# EAGLE design BLDC Motor (EAGLE 7.3.0)
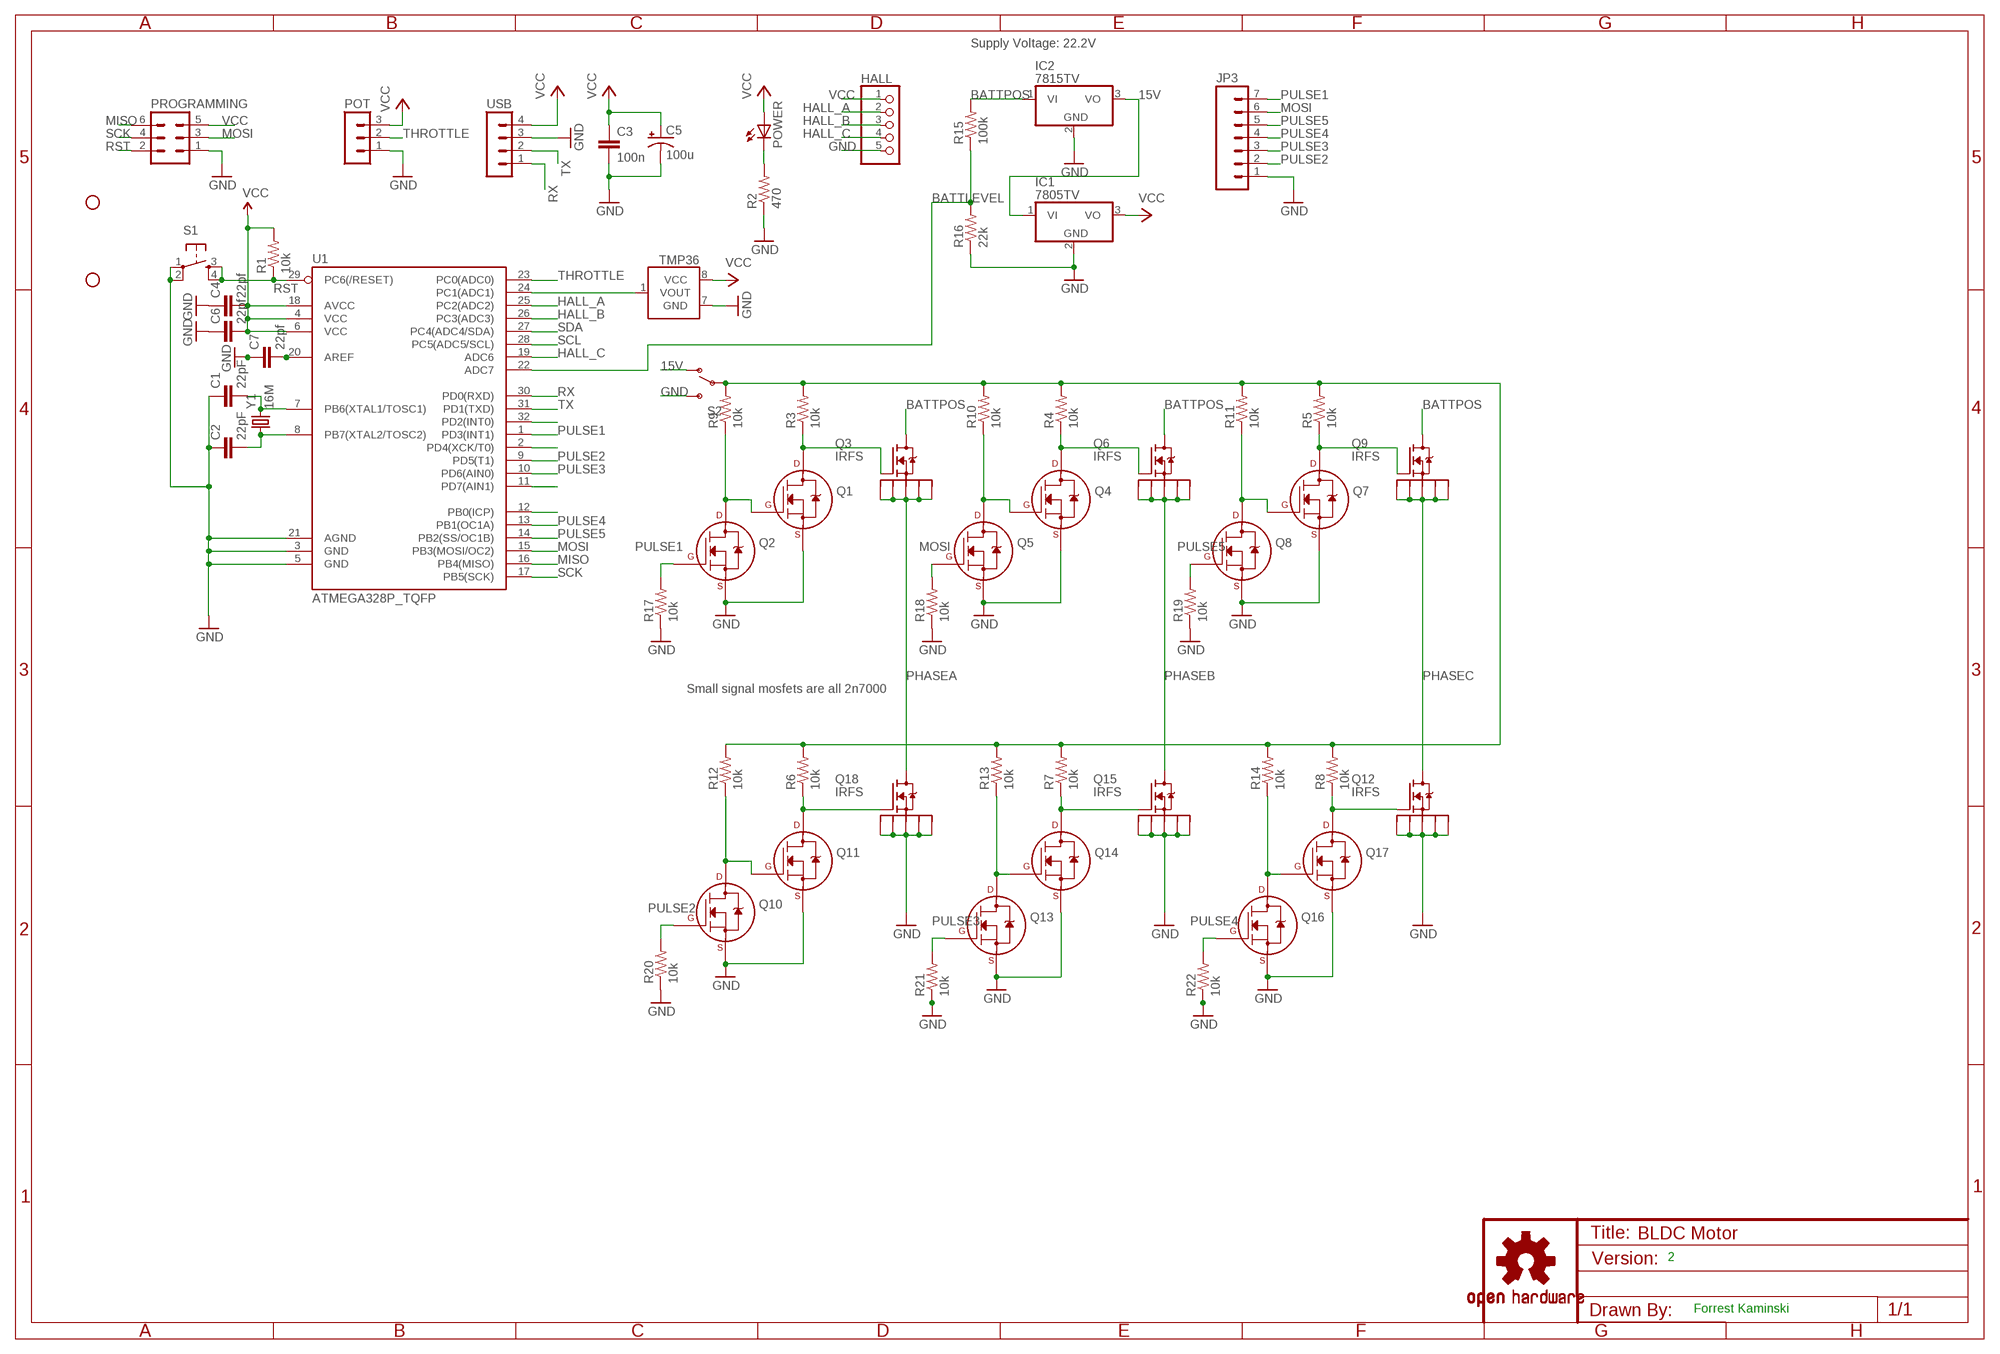
[diagram p0: schematic, sheet 1]

## Parts
C1  22pF  CAP0805  [0805]
C2  22pF  CAP0805  [0805]
C3  100n  CAP0805  [0805]
C4  22pf  CAP0805  [0805]
C5  100u  CAP_POLPTH1  [CPOL-RADIAL-100UF-25V]
C6  22pf  CAP0805  [0805]
C7  22pf  CAP0805  [0805]
HALL  PINHD-1X5  [1X05]
IC1  7805TV  [TO220V]
IC2  7815TV  [TO220V]
JP1  STAND-OFF  [STAND-OFF]
JP2  STAND-OFF  [STAND-OFF]
JP3  M07  [1X07]
POT  MA03-1  [MA03-1]
POWER  LEDSML0805  [SML0805]
PROGRAMMING  MA03-2  [MA03-2]
Q1  2N7000_TO92  [TO-92]
Q2  2N7000_TO92  [TO-92]
Q3  IRFS  NMOSFET-D2PAK-7  [D2PAK-7]
Q4  2N7000_TO92  [TO-92]
Q5  2N7000_TO92  [TO-92]
Q6  IRFS  NMOSFET-D2PAK-7  [D2PAK-7]
Q7  2N7000_TO92  [TO-92]
Q8  2N7000_TO92  [TO-92]
Q9  IRFS  NMOSFET-D2PAK-7  [D2PAK-7]
Q10  2N7000_TO92  [TO-92]
Q11  2N7000_TO92  [TO-92]
Q12  IRFS  NMOSFET-D2PAK-7  [D2PAK-7]
Q13  2N7000_TO92  [TO-92]
Q14  2N7000_TO92  [TO-92]
Q15  IRFS  NMOSFET-D2PAK-7  [D2PAK-7]
Q16  2N7000_TO92  [TO-92]
Q17  2N7000_TO92  [TO-92]
Q18  IRFS  NMOSFET-D2PAK-7  [D2PAK-7]
R1  10k  RESISTOR0805-RES  [0805]
R2  470  RESISTOR0805-RES  [0805]
R3  10k  RESISTOR0805-RES  [0805]
R4  10k  RESISTOR0805-RES  [0805]
R5  10k  RESISTOR0805-RES  [0805]
R6  10k  RESISTOR0805-RES  [0805]
R7  10k  RESISTOR0805-RES  [0805]
R8  10k  RESISTOR0805-RES  [0805]
R9  10k  RESISTOR0805-RES  [0805]
R10  10k  RESISTOR0805-RES  [0805]
R11  10k  RESISTOR0805-RES  [0805]
R12  10k  RESISTOR0805-RES  [0805]
R13  10k  RESISTOR0805-RES  [0805]
R14  10k  RESISTOR0805-RES  [0805]
R15  100k  RESISTOR0805-RES  [0805]
R16  22k  RESISTOR0805-RES  [0805]
R17  10k  RESISTOR0805-RES  [0805]
R18  10k  RESISTOR0805-RES  [0805]
R19  10k  RESISTOR0805-RES  [0805]
R20  10k  RESISTOR0805-RES  [0805]
R21  10k  RESISTOR0805-RES  [0805]
R22  10k  RESISTOR0805-RES  [0805]
S1  TAC_SWITCHPTH  [TACTILE-PTH]
S2  SWITCH-SPSTPTH_LOCK  [SWITCH-SPDT_LOCK.007S]
TMP36  TMP36SOIC  [SOIC8]
U1  ATMEGA328P_TQFP  [TQFP32-08]
U$1  OSHW-LOGOS  [OSHW-LOGO-S]
USB  MA04-1  [MA04-1]
Y1  16M  CRYSTALHC49US  [HC49US]

## Nets
15V: IC1.1(VI) IC2.3(VO) S2.1(O)
BATTLEVEL: R15.1 R16.2 U1.22(ADC7)
BATTPOS: IC2.1(VI) Q3.D Q6.D Q9.D R15.2
GND: C1.1 C2.1 C3.2 C4.1 C5.2(-) C6.1 C7.1 HALL.5 IC1.2(GND) IC2.2(GND) JP3.1 POT.1 PROGRAMMING.1 Q1.1(S) Q2.1(S) Q4.1(S) Q5.1(S) Q7.1(S) Q8.1(S) Q10.1(S) Q11.1(S) Q12.S1 Q12.S2 Q12.S3 Q12.S4 Q12.S5 Q13.1(S) Q14.1(S) Q15.S1 Q15.S2 Q15.S3 Q15.S4 Q15.S5 Q16.1(S) Q17.1(S) Q18.S1 Q18.S2 Q18.S3 Q18.S4 Q18.S5 R2.1 R16.1 R17.1 R18.1 R19.1 R20.1 R21.1 R22.1 S1.1 S1.2 S2.3(S) TMP36.7(GND) U1.3(GND) U1.5(GND) U1.21(AGND) USB.3
HALL_A: HALL.2 U1.25(PC2(ADC2))
HALL_B: HALL.3 U1.26(PC3(ADC3))
HALL_C: HALL.4 U1.19(ADC6)
MISO: PROGRAMMING.6 U1.16(PB4(MISO))
MOSI: JP3.6 PROGRAMMING.3 Q5.2(G) R18.2 U1.15(PB3(MOSI/OC2))
N$1: C2.2 U1.8(PB7(XTAL2/TOSC2)) Y1.1
N$2: C1.2 U1.7(PB6(XTAL1/TOSC1)) Y1.2
N$3: POWER.C R2.2
N$4: Q10.3(D) Q11.2(G) R12.1
N$5: Q1.3(D) Q3.G R3.1
N$6: TMP36.1(VOUT) U1.24(PC1(ADC1))
N$7: C7.2 U1.20(AREF)
N$8: Q1.2(G) Q2.3(D) R9.1
N$9: Q4.3(D) Q6.G R4.1
N$11: Q4.2(G) Q5.3(D) R10.1
N$12: R3.2 R4.2 R5.2 R6.2 R7.2 R8.2 R9.2 R10.2 R11.2 R12.2 R13.2 R14.2 S2.2(P)
N$13: Q7.3(D) Q9.G R5.1
N$14: Q7.2(G) Q8.3(D) R11.1
N$15: U1.32(PD2(INT0))
N$17: U1.2(PD4(XCK/T0))
N$19: Q11.3(D) Q18.G R6.1
N$20: U1.11(PD7(AIN1))
N$21: U1.12(PB0(ICP))
N$22: Q13.3(D) Q14.2(G) R13.1
N$26: Q12.G Q17.3(D) R8.1
N$27: Q16.3(D) Q17.2(G) R14.1
N$28: Q14.3(D) Q15.G R7.1
PHASEA: Q3.S1 Q3.S2 Q3.S3 Q3.S4 Q3.S5 Q18.D
PHASEB: Q6.S1 Q6.S2 Q6.S3 Q6.S4 Q6.S5 Q15.D
PHASEC: Q9.S1 Q9.S2 Q9.S3 Q9.S4 Q9.S5 Q12.D
PULSE1: JP3.7 Q2.2(G) R17.2 U1.1(PD3(INT1))
PULSE2: JP3.2 Q10.2(G) R20.2 U1.9(PD5(T1))
PULSE3: JP3.3 Q13.2(G) R21.2 U1.10(PD6(AIN0))
PULSE4: JP3.4 Q16.2(G) R22.2 U1.13(PB1(OC1A))
PULSE5: JP3.5 Q8.2(G) R19.2 U1.14(PB2(SS/OC1B))
RST: PROGRAMMING.2 R1.1 S1.3 S1.4 U1.29(PC6(/RESET))
RX: U1.30(PD0(RXD)) USB.1
SCK: PROGRAMMING.4 U1.17(PB5(SCK))
SCL: U1.28(PC5(ADC5/SCL))
SDA: U1.27(PC4(ADC4/SDA))
THROTTLE: POT.2 U1.23(PC0(ADC0))
TX: U1.31(PD1(TXD)) USB.2
VCC: C3.1 C4.2 C5.1(+) C6.2 HALL.1 IC1.3(VO) POT.3 POWER.A PROGRAMMING.5 R1.2 TMP36.8(VCC) U1.4(VCC) U1.6(VCC) U1.18(AVCC) USB.4

## Notes on the sheet
- Supply Voltage: 22.2V
- Small signal mosfets are all 2n7000
- 2
- Forrest Kaminski

## Library data of the parts
C1-C4 C6 C7 = SparkFun:CAP: Capacitor Standard 0603 ceramic capacitor, and 0.1" leaded capacitor.
C5 = SparkFun:CAP_POL: Capacitor Polarized These are standard SMD and PTH capacitors. Normally 10uF, 47uF, and 100uF in electrolytic and tantalum varieties. Always verify the external diameter of the through hole cap, it varies with capacity, voltage, and manufacturer. The EIA devices should be standard.
HALL = pinhead:PINHD-1X5: PIN HEADER
IC1 IC2 = linear:78*: Positive VOLTAGE REGULATOR Source: http://cache.national.com/ds/LM/LM78L05.pdf http://www.fairchildsemi.com/ds/LM/LM7805.pdf
JP1 JP2 = SparkFun:STAND-OFF: Stand Off This is the mechanical footprint for a #4 phillips button head screw. Use the keepout ring to avoid running the screw head into surrounding components. SKU : PRT-00447
JP3 = SparkFun:M07: Header 7 Standard 7-pin 0.1" header. Use with straight break away headers (SKU : PRT-00116), right angle break away headers (PRT-00553), swiss pins (PRT-00743), machine pins (PRT-00117), and female headers (PRT-00115). NOTES ON THE VARIANTS LOCK and LOCK_LONGPADS... This footprint was designed to help hold the alignment of a through-hole component (i.e. 7-pin header) while soldering it into place. You may notice that each hole has been shifted either up or down by 0.005 of an inch from it's more standard position (which is usually a perfectly straight line). This slight alteration caused the pins (the squares in the middle) to touch the edges of the holes. Because they are alternating, it causes a "brace" to hold the header in place. 0.005 has proven to be the perfect amount of "off-center" position when using our standard breakaway headers. Although looks a little odd when you look at the bare footprint, once you have a header in there, the alteration is very hard to notice. Also, if you push a header all the way into place, it is covered up entirely on the bottom side. This idea of altering the position of holes to aid alignment will be further integrated into the Sparkfun Library for other footprints. It can help hold any component with 3 or more connection pins.
POT = con-lstb:MA03-1: PIN HEADER; OC_FARNELL: unknown; OC_NEWARK: unknown
POWER = led:LED: LED OSRAM: - CHIPLED LG R971, LG N971, LY N971, LG Q971, LY Q971, LO R971, LY R971 LH N974, LH R974 LS Q976, LO Q976, LY Q976 LO Q996 - Hyper CHIPLED LW Q18S LB Q993, LB Q99A, LB R99A - SideLED LS A670, LO A670, LY A670, LG A670, LP A670 LB A673, LV A673, LT A673, LW A673 LH A674 LY A675 LS A676, LA A676, LO A676, LY A676, LW A676 LS A679, LY A679, LG A679 - Hyper Micro SIDELED® LS Y876, LA Y876, LO Y876, LY Y876 LT Y87S - SmartLED LW L88C, LW L88S LB L89C, LB L89S, LG L890 LS L89K, LO L89K, LY L89K LS L896, LA L896, LO L896, LY L896 - TOPLED LS T670, LO T670, LY T670, LG T670, LP T670 LSG T670, LSP T670, LSY T670, LOP T670, LYG T670 LG T671, LOG T671, LSG T671 LB T673, LV T673, LT T673, LW T673 LH T674 LS T676, LA T676, LO T676, LY T676, LB T676, LH T676, LSB T676, LW T676 LB T67C, LV T67C, LT T67C, LS T67K, LO T67K, LY T67K, LW E67C LS E67B, LA E67B, LO E67B, LY E67B, LB E67C, LV E67C, LT E67C LW T67C LS T679, LY T679, LG T679 LS T770, LO T770, LY T770, LG T770, LP T770 LB T773, LV T773, LT T773, LW T773 LH T774 LS E675, LA E675, LY E675, LS T675 LS T776, LA T776, LO T776, LY T776, LB T776 LHGB T686 LT T68C, LB T68C - Hyper Mini TOPLED® LB M676 - Mini TOPLED Santana® LG M470 LS M47K, LO M47K, LY M47K Source: http://www.osram.convergy.de LUXEON: - LUMILED® LXK2-PW12-R00, LXK2-PW12-S00, LXK2-PW14-U00, LXK2-PW14-V00 LXK2-PM12-R00, LXK2-PM12-S00, LXK2-PM14-U00 LXK2-PE12-Q00, LXK2-PE12-R00, LXK2-PE12-S00, LXK2-PE14-T00, LXK2-PE14-U00 LXK2-PB12-K00, LXK2-PB12-L00, LXK2-PB12-M00, LXK2-PB14-N00, LXK2-PB14-P00, LXK2-PB14-Q00 LXK2-PR12-L00, LXK2-PR12-M00, LXK2-PR14-Q00, LXK2-PR14-R00 LXK2-PD12-Q00, LXK2-PD12-R00, LXK2-PD12-S00 LXK2-PH12-R00, LXK2-PH12-S00 LXK2-PL12-P00, LXK2-PL12-Q00, LXK2-PL12-R00 Source: www.luxeon.com KINGBRIGHT: KA-3528ASYC Source: www.kingbright.com
PROGRAMMING = con-lstb:MA03-2: PIN HEADER; OC_FARNELL: unknown; OC_NEWARK: unknown
Q1 Q2 Q4 Q5 Q7 Q8 Q10 Q11 Q13 Q14 Q16 Q17 = transistors:2N700*: 2N7000, 2N7002, NDS7002A N-channel enhancement mode MOSFET
Q3 Q6 Q9 Q12 Q15 Q18 = D2PAK-7:NMOSFET-D2PAK-7
R1-R22 = SparkFun:RESISTOR: Resistor Basic schematic elements and footprints for 0603, 1206, and PTH resistors.
S1 = SparkFun:TAC_SWITCH: Momentary Switch Button commonly used for reset or general input. Spark Fun Electronics SKU : COM-00097
S2 = SparkFun:SWITCH-SPST: SPST Switch Simple slide switch. Spark Fun Electronics SKU : COM-00102
TMP36 = SparkFun:TMP36
U1 = SparkFun-DigitalIC:ATMEGA328P_TQFP; PROD_ID: IC-09069
U$1 = SparkFun:OSHW-LOGO: Open Source Hardware Logo This logo indicates the piece of hardware it is found on incorporates a OSHW license and/or adheres to the definition of open source hardware found here: http://freedomdefined.org/OSHW
USB = con-lstb:MA04-1: PIN HEADER; OC_FARNELL: unknown; OC_NEWARK: unknown
Y1 = SparkFun:CRYSTAL: Crystals Various standard crystals. Proven footprints. Spark Fun Electronics SKU : COM-00534

## Net classes
0 default: width 0.254 mm, drill 0.152 mm, clearance 0.203 mm

## Board
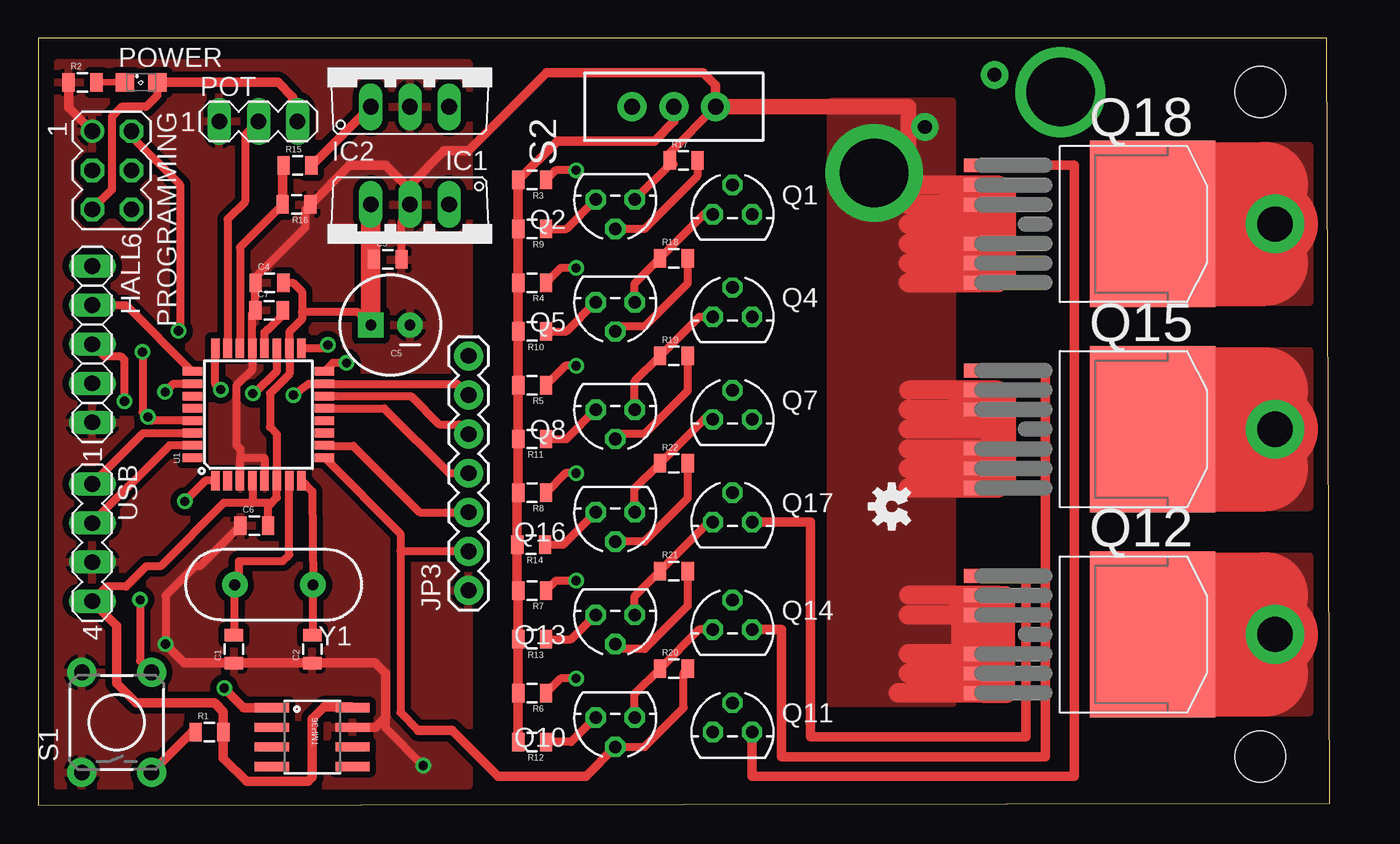
[diagram p1: board, top side]
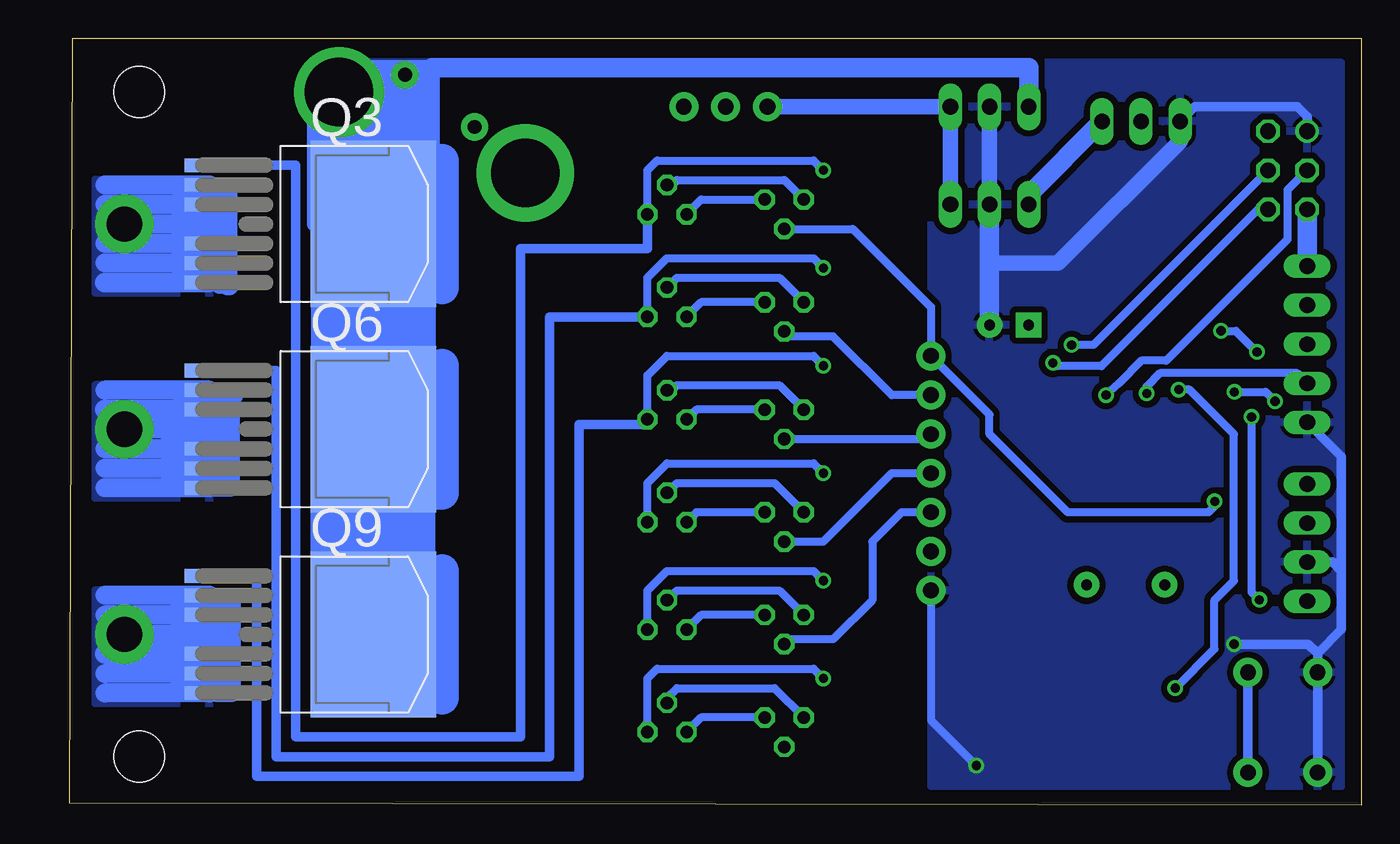
[diagram p2: board, bottom side, seen from below]

Size 83.87 x 49.84 mm. Coordinates in mm from the lower left corner, seen from the top.
Outline: 0,0 83.87,0.13 83.68,49.84 0,49.84 0,0
Copper layers (1*16): Top 0.035mm / dielectric 1.5mm / Bottom 0.035mm
Design rules "default *": minimum track width 10mil, minimum drill 21mil, track to track 8mil, track to pad 8mil, pad to pad 8mil, via to via 8mil, smd to smd 8mil, copper to edge 20mil, drill to drill 8mil, minimum pad ring 10mil, minimum via ring 8mil, stop-mask expansion 4mil, vias tented up to drill 0mil, thermal gap 10mil

### Footprints (pad centres in the part's own frame; a part is rotated, then mirrored left to right if it is on the bottom)
0805 = smd 0.8 x 1.2: 1 -0.9,0; 2 0.9,0
CPOL-RADIAL-100UF-25V = drill 0.7 pad 1.651 square: 1 1.27,0 | drill 0.7 pad 1.651: 2 -1.27,0
1X05 = drill 1.016 long: 1 -5.08,0; 2 -2.54,0; 3 0,0; 4 2.54,0; 5 5.08,0
TO220V = drill 1.016 long: 1 -2.54,-2.54; 2 0,-2.54; 3 2.54,-2.54
STAND-OFF = hole 3.302: 0,0
1X07 = drill 1.016 pad 1.88: 1 0,0; 2 2.54,0; 3 5.08,0; 4 7.62,0; 5 10.16,0; 6 12.7,0; 7 15.24,0
MA03-1 = drill 1.016 long: 1 -2.54,0; 2 0,0; 3 2.54,0
SML0805 = smd 1.2 x 1.2: A 1.05,0; C -1.05,0
MA03-2 = drill 1.016: 1 -2.54,-1.27 | drill 1.016 octagon: 2 -2.54,1.27; 3 0,-1.27; 4 0,1.27; 5 2.54,-1.27; 6 2.54,1.27
TO-92 = drill 0.813 octagon: 1 -1.27,0; 2 0,1.905; 3 1.27,0
D2PAK-7 = smd 10.8 x 8.15: D 0,4.1 | smd 0.9 x 3.2: G -3.81,-6.56; S1 -2.54,-6.56; S2 -1.27,-6.56; S3 1.27,-6.56; S4 2.54,-6.56; S5 3.81,-6.56
TACTILE-PTH = drill 1.016 pad 1.88: 1 -3.251,2.261; 2 3.251,2.261; 3 -3.251,-2.261; 4 3.251,-2.261
SWITCH-SPDT_LOCK.007S = drill 1.016 pad 1.88: 1 0,2.718; 2 0,0; 3 0,-2.718
SOIC8 = smd 0.61 x 2.21: 1 -1.905,-2.616; 2 -0.635,-2.616; 3 0.635,-2.616; 4 1.905,-2.616; 5 1.905,2.616; 6 0.635,2.616; 7 -0.635,2.616; 8 -1.905,2.616
TQFP32-08 = smd 1.27 x 0.559: 1 -4.293,2.8; 2 -4.293,2; 3 -4.293,1.2; 4 -4.293,0.4; 5 -4.293,-0.4; 6 -4.293,-1.2; 7 -4.293,-2; 8 -4.293,-2.8; 17 4.293,-2.8; 18 4.293,-2; 19 4.293,-1.2; 20 4.293,-0.4; 21 4.293,0.4; 22 4.293,1.2; 23 4.293,2; 24 4.293,2.8 | smd 0.559 x 1.27: 9 -2.8,-4.293; 10 -2,-4.293; 11 -1.2,-4.293; 12 -0.4,-4.293; 13 0.4,-4.293; 14 1.2,-4.293; 15 2,-4.293; 16 2.8,-4.293; 25 2.8,4.293; 26 2,4.293; 27 1.2,4.293; 28 0.4,4.293; 29 -0.4,4.293; 30 -1.2,4.293; 31 -2,4.293; 32 -2.8,4.293
MA04-1 = drill 1.016 long: 1 -3.81,0; 2 -1.27,0; 3 1.27,0; 4 3.81,0
HC49US = drill 0.7 pad 1.651: 1 -2.54,0; 2 2.54,0

### Placement (x,y rotation side)
C1  12.7,10.16 90 top
C2  17.78,10.16 90 top
C3  22.69,35.48 0 top
C4  15.01,33.96 0 top
C5  22.86,31.22 180 top
C6  14.02,18.19 0 top
C7  14.99,32.18 0 top
HALL  3.49,29.97 270 top
IC1  24.13,36.51 180 top
IC2  24.13,47.94 0 top
JP1  79.38,46.35 0 top
JP2  79.38,3.17 0 top
JP3  27.94,13.97 90 top
POT  14.29,44.45 0 top
POWER  6.67,46.99 0 top
PROGRAMMING  4.76,41.27 270 top
Q1  45.09,38.42 0 top
Q2  37.47,39.37 180 top
Q3  68.26,37.78 270 bottom
Q4  45.09,31.75 0 top
Q5  37.47,32.7 180 top
Q6  68.26,24.45 270 bottom
Q7  45.09,25.08 0 top
Q8  37.47,25.72 180 top
Q9  68.26,11.11 270 bottom
Q10  37.47,5.71 180 top
Q11  45.09,4.76 0 top
Q12  68.26,11.11 270 top
Q13  37.47,12.38 180 top
Q14  45.09,11.43 0 top
Q15  68.26,24.45 270 top
Q16  37.47,19.05 180 top
Q17  45.09,18.41 0 top
Q18  68.26,37.78 270 top
R1  11.11,4.76 0 top
R2  2.86,46.99 0 top
R3  32.07,40.64 180 top
R4  32.07,33.97 180 top
R5  32.07,27.3 180 top
R6  32.07,7.3 180 top
R7  32.07,13.97 180 top
R8  32.07,20.32 180 top
R9  32.07,37.47 180 top
R10  32.07,30.8 180 top
R11  32.07,23.81 180 top
R12  32.07,4.13 180 top
R13  32.07,10.79 180 top
R14  32,16.95 180 top
R15  16.83,41.59 0 top
R16  16.76,39.05 180 top
R17  41.91,41.91 0 top
R18  41.27,35.56 0 top
R19  41.27,29.21 0 top
R20  41.27,8.89 0 top
R21  41.27,15.24 0 top
R22  41.27,22.23 0 top
S1  5.08,5.4 90 top
S2  41.27,45.4 90 top
TMP36  17.78,4.45 270 top
U1  14.29,25.4 90 top
U$1  55.44,19.43 90 top
USB  3.49,17.08 270 top
Y1  15.29,14.34 180 top

### Tracks (layer width: path | path; a pad name or v marks a point on that pad's centre or on a via)
15V
  Bottom 1.016: IC1.1 IC2.3 S2.1
BATTLEVEL
  Top 0.508: R16.2 13.09,36.28 U1.22
  Top 0.61: R16.2 15.86,41.53 R15.1
BATTPOS  (via drill 0.9 pad 1.78, 4.45 pad 5.84)
  Top 0.61: IC2.1 17.78,41.59 R15.2
  Bottom 0.406: 67.97,47.94 66.7,47.94
  Bottom 1.016: 60.99,47.94 60.35,47.94 60.35,37.78 | 60.99,47.94 61.62,47.94 | 61.62,47.94 62.26,47.94 | 62.26,47.94 62.89,47.94 | 62.89,47.94 63.53,47.94 | 63.53,47.94 64.16,47.94 Q3.D | 63.53,47.94 63.53,37.78 | 62.89,47.94 62.89,37.78 | 62.26,47.94 62.26,37.78 | 61.62,47.94 61.62,37.78 | 60.99,47.94 60.99,37.78 | 64.8,47.94 64.8,37.78 | 65.43,47.94 65.43,37.78 | 66.07,47.94 66.07,37.78 | 66.7,47.94 66.7,37.78 | 67.34,47.94 67.34,37.78 | 67.97,47.94 67.97,37.78
  Bottom 1.27: IC2.1 21.59,47.94 60.35,47.94 | 59.69,13.34 64.16,13.34 | 64.16,19.68 64.16,20.32 | 60.35,37.78 59.69,37.78
  Bottom 2.184: 59.69,41.91 59.69,37.78 59.69,33.66 | 59.69,28.57 59.69,20.32 64.16,20.32 | 59.69,15.24 59.69,13.34 59.69,6.99
  Bottom 8.128: Q3.D Q6.D 64.16,21.59 64.16,20.32 64.16,13.34 Q9.D
  other vias: 66.4,46.35 62.1,47.47
  pour Bottom: 60.33,43.18 60.33,48.26 67.94,48.26 67.94,43.18
GND  (via drill 0.6, 0.9 pad 1.78, 4.45 pad 6.35)
  Top 0.508: U1.3 13.11,21.13 13.11,22.61 | 13.11,22.61 14.63,22.61 14.69,22.55 U1.5 | 13.11,22.61 13.11,23.16 12.85,23.42 12.85,27.28 13.87,28.3 13.87,29.67 U1.21 13.89,31.98 C7.1 14.09,33.93 C4.1 14.11,34.33 17.36,37.57 17.36,38.74 R16.1 | 22.54,8.57 22.54,5.04 v24.99,2.59 | C3.2 23.59,37.97 24.13,38.51 IC1.2 | C6.1 10.48,15.54 10.16,15.54 8.26,13.64 v8.26,10.48 | Q10.1 38.73,7.25 R20.1 42.91,11.43 Q14.1 | Q13.1 38.73,13.6 R21.1 43.55,18.41 Q17.1 | Q16.1 38.73,20.59 R22.1 43.23,25.08 Q7.1 | Q8.1 38.73,27.57 R19.1 42.91,31.75 Q4.1 | Q5.1 38.73,33.92 R18.1 43.23,38.42 Q1.1 | R17.1 41.01,41.65 Q2.1 | 41.27,41.65 R17.1 | R17.1 41.01,42.42 S2.3
  Top 0.61: 55.88,7.3 55.88,7.62 57.78,7.62 | R16.1 20.2,41.59 22.54,41.59 24.13,40.01 IC1.2 24.13,40.32 26.35,42.55 27.94,42.55 33.02,47.62 43.18,47.62 43.99,46.81 S2.3 | R2.1 1.96,45.35 PROGRAMMING.1 | TMP36.7 21.91,5.08 22.54,5.71 22.54,8.57 21.86,9.26 C2.1 C1.1 9.47,9.26 v8.26,10.48
  Top 0.813: 43.81,45.4 S2.3
  Top 1.016: S2.3 56.52,45.4 56.52,40.32 | 62.34,40.32 Q18.S1 Q18.S2 | Q18.S3 58.42,36.51 58.42,37.78 | Q18.S4 Q18.S5 | Q15.S1 62.23,26.99 62.23,26.67 | 62.23,26.67 62.23,25.72 | 62.34,23.18 Q15.S3 Q15.S4 | Q15.S2 Q15.S5 | 62.34,9.84 Q12.S3 Q12.S2 | 61.07,9.84 61.07,12.38 | 60.43,9.84 60.43,12.38 | 59.8,9.84 59.8,12.38 | 62.87,26.67 62.23,26.67 | 62.23,7.62 62.02,7.62 Q12.S5
  Top 1.219: 62.34,13.65 Q12.S1 56.52,13.65 | 62.34,26.99 Q15.S1 56.52,26.99 | 62.34,40.32 56.52,40.32
  Top 1.27: 60.88,7.3 Q12.S5 62.34,7.3 | 60.88,7.3 55.88,7.3 | 62.34,8.57 Q12.S4 56.52,8.57 | 62.34,9.84 61.07,9.84 60.43,9.84 59.8,9.84 56.52,9.84 | 62.34,12.38 Q12.S2 | Q12.S2 61.07,12.38 60.43,12.38 59.8,12.38 56.52,12.38 | 62.34,24.45 56.52,24.45 | 62.34,20.64 Q15.S5 56.52,20.64 | 62.34,21.91 Q15.S4 56.52,21.91 | 62.34,23.18 56.52,23.18 | 62.34,25.72 62.23,25.72 Q15.S2 | Q15.S2 56.52,25.72 | 62.34,37.78 58.42,37.78 56.52,37.78 | 62.34,33.97 Q18.S5 56.52,33.97 | 62.34,35.24 Q18.S4 56.52,35.24 | 62.34,36.51 Q18.S3 56.52,36.51 | 62.34,39.05 Q18.S2 | Q18.S2 56.52,39.05 | 62.87,34.29 62.87,40.01 62.66,40.01 Q18.S2 | 62.87,26.67 62.87,20.95 | 62.23,13.34 62.23,7.62 | 59.05,39.37 60.96,39.37 | 59.69,26.67 61.59,26.67 61.59,25.82 Q15.S2 | 59.69,12.7 61.59,12.7 61.59,12.49 Q12.S2 | 62.81,7.29 61.44,7.29 60.88,7.85 60.88,7.3 | 62.87,7.29 62.81,7.29 | 62.81,7.29 62.81,13.61 61.98,13.61
  Bottom 0.508: Q10.1 42.86,5.71 Q11.1 | Q13.1 42.86,12.38 Q14.1 | Q16.1 43.18,19.05 Q17.1 | Q8.1 43.18,25.72 Q7.1 | Q5.1 42.86,32.7 Q4.1 | Q1.1 42.86,39.37 Q2.1 | JP3.1 27.94,5.54 v24.99,2.59
  Bottom 0.61: S1.1 S1.2 2.82,9.88 | PROGRAMMING.1 3.49,44.77 4.13,45.4 10.79,45.4 POT.1 | 2.82,9.88 1.27,11.43 1.27,15.24 | 1.27,15.24 1.84,15.81 USB.3 | 2.82,9.88 3.42,10.48 v8.26,10.48 | HALL.5 1.27,22.67 1.27,15.24
  Bottom 1.016: IC2.2 IC1.2 | POT.1 11.75,43.18 19.68,35.24 23.81,35.24 24.13,34.92
  Bottom 1.27: C5.2 24.13,34.92 IC1.2
  other vias: 54.29,41.1 57.58,44.09
  pour Top: 59.37,45.72 51.44,45.72 51.44,6.67 59.37,6.67
  pour Top (isolate 0.406): 1.27,48.26 27.94,48.26 27.94,1.27 1.27,1.27
  pour Bottom (isolate 0.406): 1.27,48.26 27.94,48.26 27.94,1.27 1.27,1.27
HALL_A
  Top 0.508: HALL.2 5.68,32.51 U1.25
HALL_B  (via drill 0.6)
  Top 0.508: U1.26 8.76,27.4 v8.23,26.87 | v5.59,26.26 5.59,28.96 5.38,29.16 4.3,29.16 HALL.3
  Bottom 0.508: v8.23,26.87 6.2,26.87 v5.59,26.26
HALL_C  (via drill 0.6)
  Top 0.508: U1.19 15.49,28.25 14.02,26.77 v13.92,26.77
  Bottom 0.508: HALL.4 4.15,28.09 13.06,28.09 13.92,27.23 v13.92,26.77
MISO  (via drill 0.6)
  Top 0.508: v20.02,28.75 19.13,28.75 U1.16
  Bottom 0.508: PROGRAMMING.6 6.68,38.73 16.87,28.55 19.81,28.55 v20.02,28.75
MOSI  (via drill 0.6)
  Top 0.508: v16.56,26.67 17.56,27.4 U1.15 27.21,27.4 JP3.6 | R18.2 42.17,33.92 39.37,31.11 37.78,31.11 Q5.2
  Bottom 0.508: PROGRAMMING.3 4.78,39.99 4.78,36.78 12.65,28.91 14.28,28.91 15.75,27.43 v16.56,26.67 | JP3.6 30.48,26.67 34.29,30.48 37.15,30.48 Q5.2
N$1
  Top 0.508: U1.8 17.78,20.41 Y1.1 17.83,11.11 C2.2
N$2
  Top 0.508: U1.7 16.29,16.29 15.88,15.88 13.02,15.88 13.02,14.61 Y1.2 12.75,11.11 C1.2
N$3
  Top 0.406: POWER.C R2.2
N$4
  Top 0.508: Q10.3 34.61,4.13 R12.1
  Bottom 0.508: Q11.2 45.09,6.99 44.45,7.62 38.1,7.62 Q10.3
N$5  (via drill 0.6)
  Top 0.508: v34.92,41.27 33.6,41.27 R3.1
  Bottom 0.508: Q1.3 46.35,41.27 45.72,41.91 35.56,41.91 v34.92,41.27
  Bottom 0.61: Q3.G 69.22,41.59 69.22,4.45 54.61,4.45 54.61,36.2 46.35,36.2 Q1.3
N$6  (via drill 0.6)
  Top 0.508: U1.24 11.49,27.38 v11.84,27.03
  Top 0.61: TMP36.1 13.34,6.35 v12.06,7.62
  Bottom 0.508: v12.06,7.62 9.53,10.16 9.53,13.34 8.26,14.61 8.26,24.13 11.15,27.03 v11.84,27.03
N$7
  Top 0.508: U1.20 14.69,30.74 14.88,30.94 14.94,30.94 15.89,31.89 C7.2
N$8
  Top 0.508: R9.1 34.29,37.47 Q2.3
  Bottom 0.508: Q1.2 44.77,40.32 44.45,40.64 37.47,40.64 Q2.3
N$9  (via drill 0.6)
  Top 0.508: v34.92,34.92 33.92,34.92 R4.1
  Bottom 0.508: Q4.3 46.35,34.29 45.09,35.56 35.56,35.56 v34.92,34.92
  Bottom 0.61: Q6.G 70.48,28.26 70.48,3.17 52.7,3.17 52.7,31.75 Q4.3
N$11
  Top 0.508: R10.1 34.29,30.8 Q5.3
  Bottom 0.508: Q4.2 44.45,34.29 37.78,34.29 Q5.3
N$12
  Top 0.61: S2.2 41.27,44.45 40.01,43.18 33.71,43.18 R3.2 R9.2 R4.2 R10.2 R5.2 R11.2 R8.2 31.1,20.32 R14.2 31.1,13.97 R7.2 R13.2 R6.2 R12.2
N$13  (via drill 0.6)
  Top 0.508: v34.92,28.57 34.24,28.57 R5.1
  Bottom 0.508: Q7.3 46.35,27.94 45.09,29.21 35.56,29.21 v34.92,28.57
  Bottom 0.61: Q9.G 71.75,14.92 71.75,1.91 50.8,1.91 50.8,24.77 46.35,24.77 Q7.3
N$14
  Top 0.508: R11.1 34.29,23.81 Q8.3
  Bottom 0.508: Q7.2 44.77,26.99 44.45,27.3 37.78,27.3 Q8.3
N$19  (via drill 0.6)
  Top 0.508: v34.92,8.26 33.92,8.26 R6.1
  Top 0.61: Q18.G 67.31,41.59 67.31,1.91 46.35,1.91 Q11.3
  Bottom 0.508: Q11.3 46.35,8.26 45.72,8.89 35.56,8.89 v34.92,8.26
N$22
  Top 0.508: R13.1 34.61,10.79 Q13.3
  Bottom 0.508: Q14.2 44.45,13.97 37.78,13.97 Q13.3
N$26  (via drill 0.6)
  Top 0.508: v34.92,21.59 34.24,21.59 R8.1
  Top 0.61: Q12.G 64.14,14.92 64.14,4.45 50.16,4.45 50.16,18.41 Q17.3
  Bottom 0.508: Q17.3 46.35,20.95 45.09,22.23 35.56,22.23 v34.92,21.59
N$27
  Top 0.508: R14.1 34.1,16.95 Q16.3
  Bottom 0.508: Q17.2 44.45,20.95 38.1,20.95 Q16.3
N$28  (via drill 0.6)
  Top 0.508: v34.92,14.61 33.6,14.61 R7.1
  Top 0.61: Q15.G 65.41,28.26 65.41,3.17 48.26,3.17 48.26,11.43 Q14.3
  Bottom 0.508: Q14.3 46.35,13.97 45.09,15.24 35.56,15.24 v34.92,14.61
PHASEA  (via drill 2.29 pad 3.81)
  Top 5.588: Q18.D v80.33,37.78 | 72.36,40.32 79.69,40.32 | 72.36,35.24 79.69,35.24
  Bottom 0.61: Q3.S1 Q3.S2 74.82,38.1 74.82,37.78 Q3.S3 Q3.S4 Q3.S5
  Bottom 1.016: 76.2,39.37 75.88,39.37 75.56,39.05
  Bottom 1.219: Q3.S1 81.6,40.32 | Q3.S2 75.56,39.05 81.6,39.05 | 74.82,37.78 81.6,37.78 | Q3.S3 81.6,36.51 | Q3.S4 81.6,35.24
  Bottom 1.27: Q3.S5 81.6,33.97 | 74.02,39.65 74.14,39.65 74.14,33.88 73.53,33.88 73.53,33.78 73.64,33.78 73.64,40.06 75.16,40.06 75.16,38.44 74.82,38.1
  Bottom 2.184: 76.2,39.37 76.2,34.92
  pour Bottom: 74.61,40.64 82.23,40.64 82.23,33.34 74.61,33.34
  pour Top: 68.58,42.86 82.55,42.86 82.55,32.7 68.58,32.7
PHASEB  (via drill 2.29 pad 3.81)
  Top 5.588: Q15.D v80.33,24.45 | 72.36,21.91 79.69,21.91 | 72.36,26.99 79.69,26.99
  Bottom 0.61: Q6.S1 Q6.S2 74.82,24.45 Q6.S3 Q6.S4 Q6.S5
  Bottom 1.016: 76.83,25.4 76.83,26.04 74.93,26.04 74.82,25.93 Q6.S2 | 76.83,25.4 77.47,24.77 77.47,20.95 | 76.2,25.4 76.83,25.4
  Bottom 1.219: Q6.S1 81.6,26.99 | 74.82,24.45 v80.33,24.45 81.6,24.45 | Q6.S3 81.6,23.18 | Q6.S4 81.6,21.91 | Q6.S5 81.6,20.64
  Bottom 1.27: Q6.S2 81.6,25.72 | 73.28,26.62 73.46,26.62 73.46,20.7 74.5,20.7 74.5,21.58 | 74.5,21.58 74.5,26.52 | 74.5,21.58 Q6.S4
  Bottom 2.184: 75.56,21.59 76.2,21.59 76.2,25.4
  pour Bottom: 74.61,27.3 82.23,27.3 82.23,20 74.61,20
  pour Top: 68.58,29.53 82.55,29.53 82.55,19.37 68.58,19.37
PHASEC  (via drill 2.29 pad 3.81)
  Top 5.588: Q12.D v80.33,11.11 | 72.36,13.65 79.69,13.65 | 72.36,8.57 79.69,8.57
  Bottom 0.508: Q9.S5 Q9.S4 Q9.S3 74.93,9.84 74.93,11.11 74.93,12.38 Q9.S2 Q9.S1
  Bottom 1.016: 74.93,8.26 75.56,8.26 75.56,12.06 76.2,12.06 76.2,7.62 76.83,7.62 76.83,13.34 74.93,13.34 74.93,12.49 Q9.S2
  Bottom 1.219: Q9.S1 81.6,13.65 | Q9.S2 81.6,12.38 | Q9.S4 81.6,8.57 | Q9.S5 81.6,7.3
  Bottom 1.27: 74.82,11.11 74.93,11.11 v80.33,11.11 81.6,11.11 | Q9.S3 81.6,9.84 | 73.58,13.21 73.41,13.21 73.41,7.34 74.32,7.34 74.32,8.07 | 74.32,8.07 74.32,13.18 | 74.32,8.07 Q9.S4
  pour Bottom: 74.61,13.97 82.23,13.97 82.23,6.67 74.61,6.67
  pour Top: 68.58,16.19 82.55,16.19 82.55,6.03 68.58,6.03
PULSE1  (via drill 0.6)
  Top 0.508: U1.1 10.85,21.11 v9.5,19.76 | R17.2 42.81,40.91 39.37,37.47 Q2.2
  Bottom 0.508: v9.5,19.76 9.5,19.46 9.91,19.05 19.05,19.05 24.13,24.13 24.13,25.4 JP3.7 27.94,32.38 33.02,37.47 Q2.2
PULSE2
  Top 0.508: U1.9 23.52,17.66 23.52,16.51 | 23.52,16.51 23.52,6.04 24.68,4.89 | Q10.2 39.37,3.81 41.91,6.35 41.91,8.62 R20.2 | JP3.2 23.52,16.51
  Top 0.61: 24.68,4.89 26.86,4.89 29.84,1.91 35.56,1.91 Q10.2
PULSE3
  Top 0.508: U1.10 18.61,23.37 20.45,23.37 24.77,19.05 JP3.3 | R21.2 42.17,12.96 39.37,10.16 37.78,10.16 Q13.2
  Bottom 0.508: JP3.3 29.84,19.05 31.75,17.14 31.75,13.34 34.29,10.79 37.15,10.79 Q13.2
PULSE4
  Top 0.508: R22.2 42.17,19.95 39.37,17.14 Q16.2 | U1.13 22.46,25.8 26.67,21.59 JP3.4
  Bottom 0.508: Q16.2 34.92,17.14 30.48,21.59 JP3.4
PULSE5
  Top 0.508: R19.2 42.17,26.93 39.37,24.13 37.78,24.13 Q8.2 | U1.14 24.2,26.6 26.04,24.77 27.3,24.77 JP3.5
  Bottom 0.508: Q8.2 28.26,23.81 JP3.5
RST  (via drill 0.6)
  Top 0.508: PROGRAMMING.2 6.03,43.5 9.2,40.34 9.2,30.94 v9.09,30.84 | v6.76,29.46 6.76,25.55 v7.11,25.25 7.36,25 U1.29 | v6.6,13.36 6.6,9.38 S1.4
  Top 0.61: R1.1 9.96,4.76 S1.3
  Bottom 0.508: v9.09,30.84 8.13,30.84 v6.76,29.46 | v7.11,25.25 7.11,13.87 v6.6,13.36
  Bottom 0.61: S1.3 S1.4
RX
  Top 0.508: USB.1 6.8,24.2 U1.30
SCK  (via drill 0.6)
  Top 0.508: v18.8,29.92 18.57,29.69 U1.17
  Bottom 0.508: PROGRAMMING.4 17.39,29.92 v18.8,29.92
THROTTLE
  Top 0.508: POT.2 13.41,43.57 13.41,39.22 12.29,38.09 U1.23
TX
  Top 0.508: U1.31 8.52,23.4 3.49,18.38 USB.2
VCC
  Top 0.508: POWER.A 7.72,46.13 6.99,45.4 5.4,45.4 4.76,44.77 4.76,40.01 PROGRAMMING.5 | U1.4 13.92,21.08 13.92,19.66 | 13.92,19.66 12.04,19.66 7.92,15.54 7.01,15.54 5.69,14.22 4.45,14.22 USB.4 | 15.14,19.66 13.92,19.66 | 15.14,19.66 15.49,20.01 U1.6 15.49,24.14 15.04,24.59 15.04,26.77 16.31,28.04 16.31,29.67 U1.18 16.29,30.77 17.12,31.6 17.12,32.05 | C6.2 14.92,19.44 15.14,19.66 | C3.1 21.8,38.85 IC1.3 | C4.2 16.54,33.96 17.12,33.38 17.12,32.05 | C5.1 20.75,32.05 17.12,32.05
  Top 0.61: POWER.A 15.56,46.99 16.51,46.04 16.51,44.77 POT.3 | USB.4 5.08,11.68 5.08,7.94 6.35,6.67 11.43,6.67 12.01,6.08 R1.2 12.01,3.08 13.51,1.57 17.53,1.57 17.78,1.83 17.78,5.64 18.54,6.4 20.34,6.4 TMP36.8
  Top 1.27: C5.1 IC1.3
  Bottom 1.27: IC1.3 21.59,39.69 POT.3 | PROGRAMMING.5 HALL.1

### Text on the board
tStop: Forrest Kaminski / Thuan Pham / Justin Morgan / Team 12